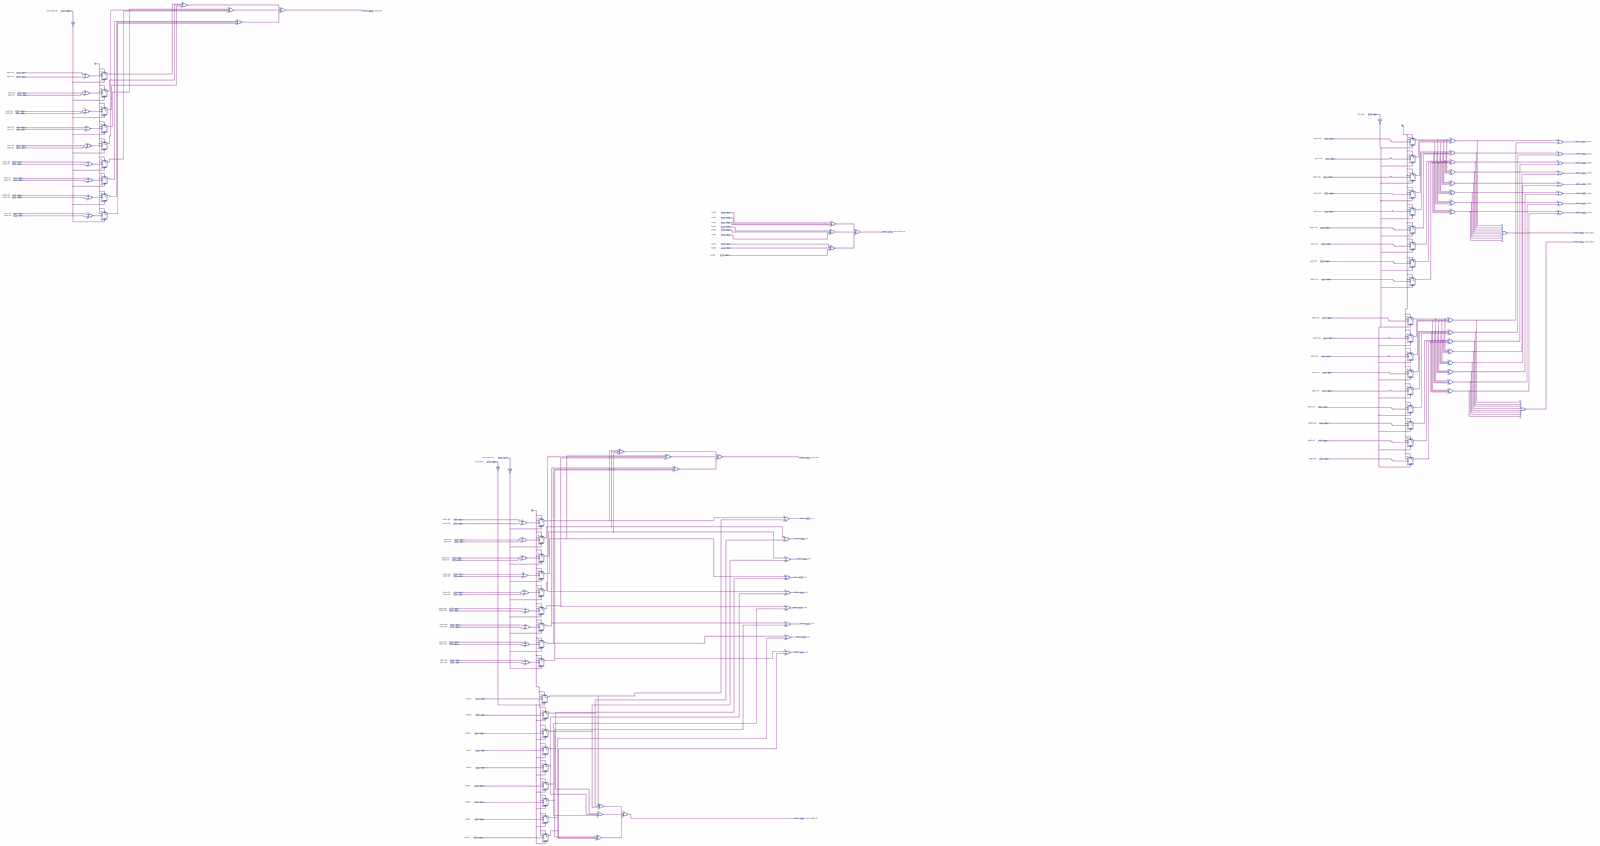
[diagram p0: schematic sheet, whole]
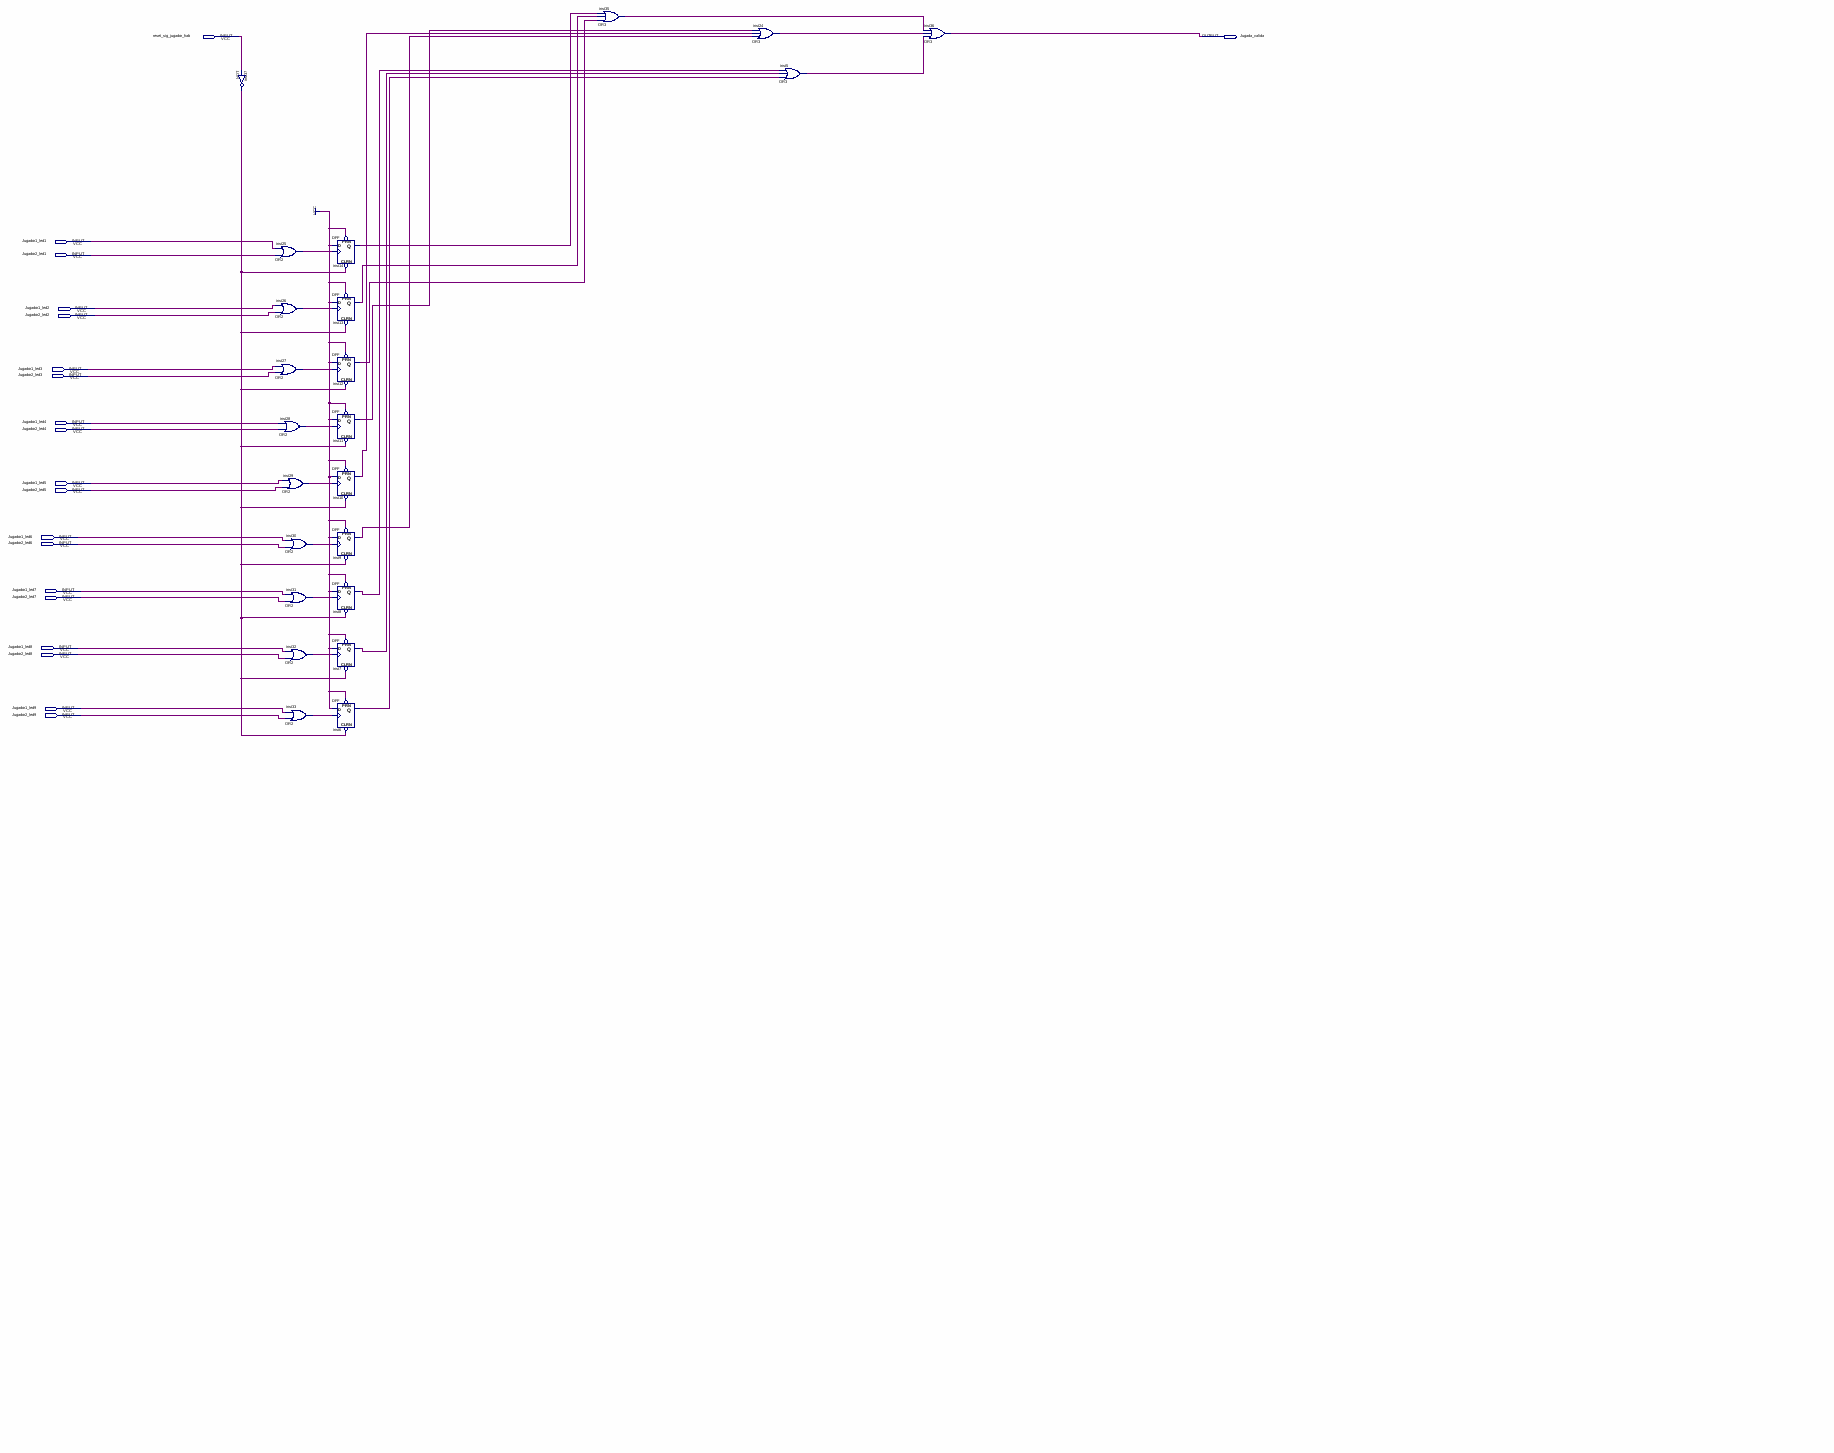
[diagram p1: schematic sheet, upper left part]
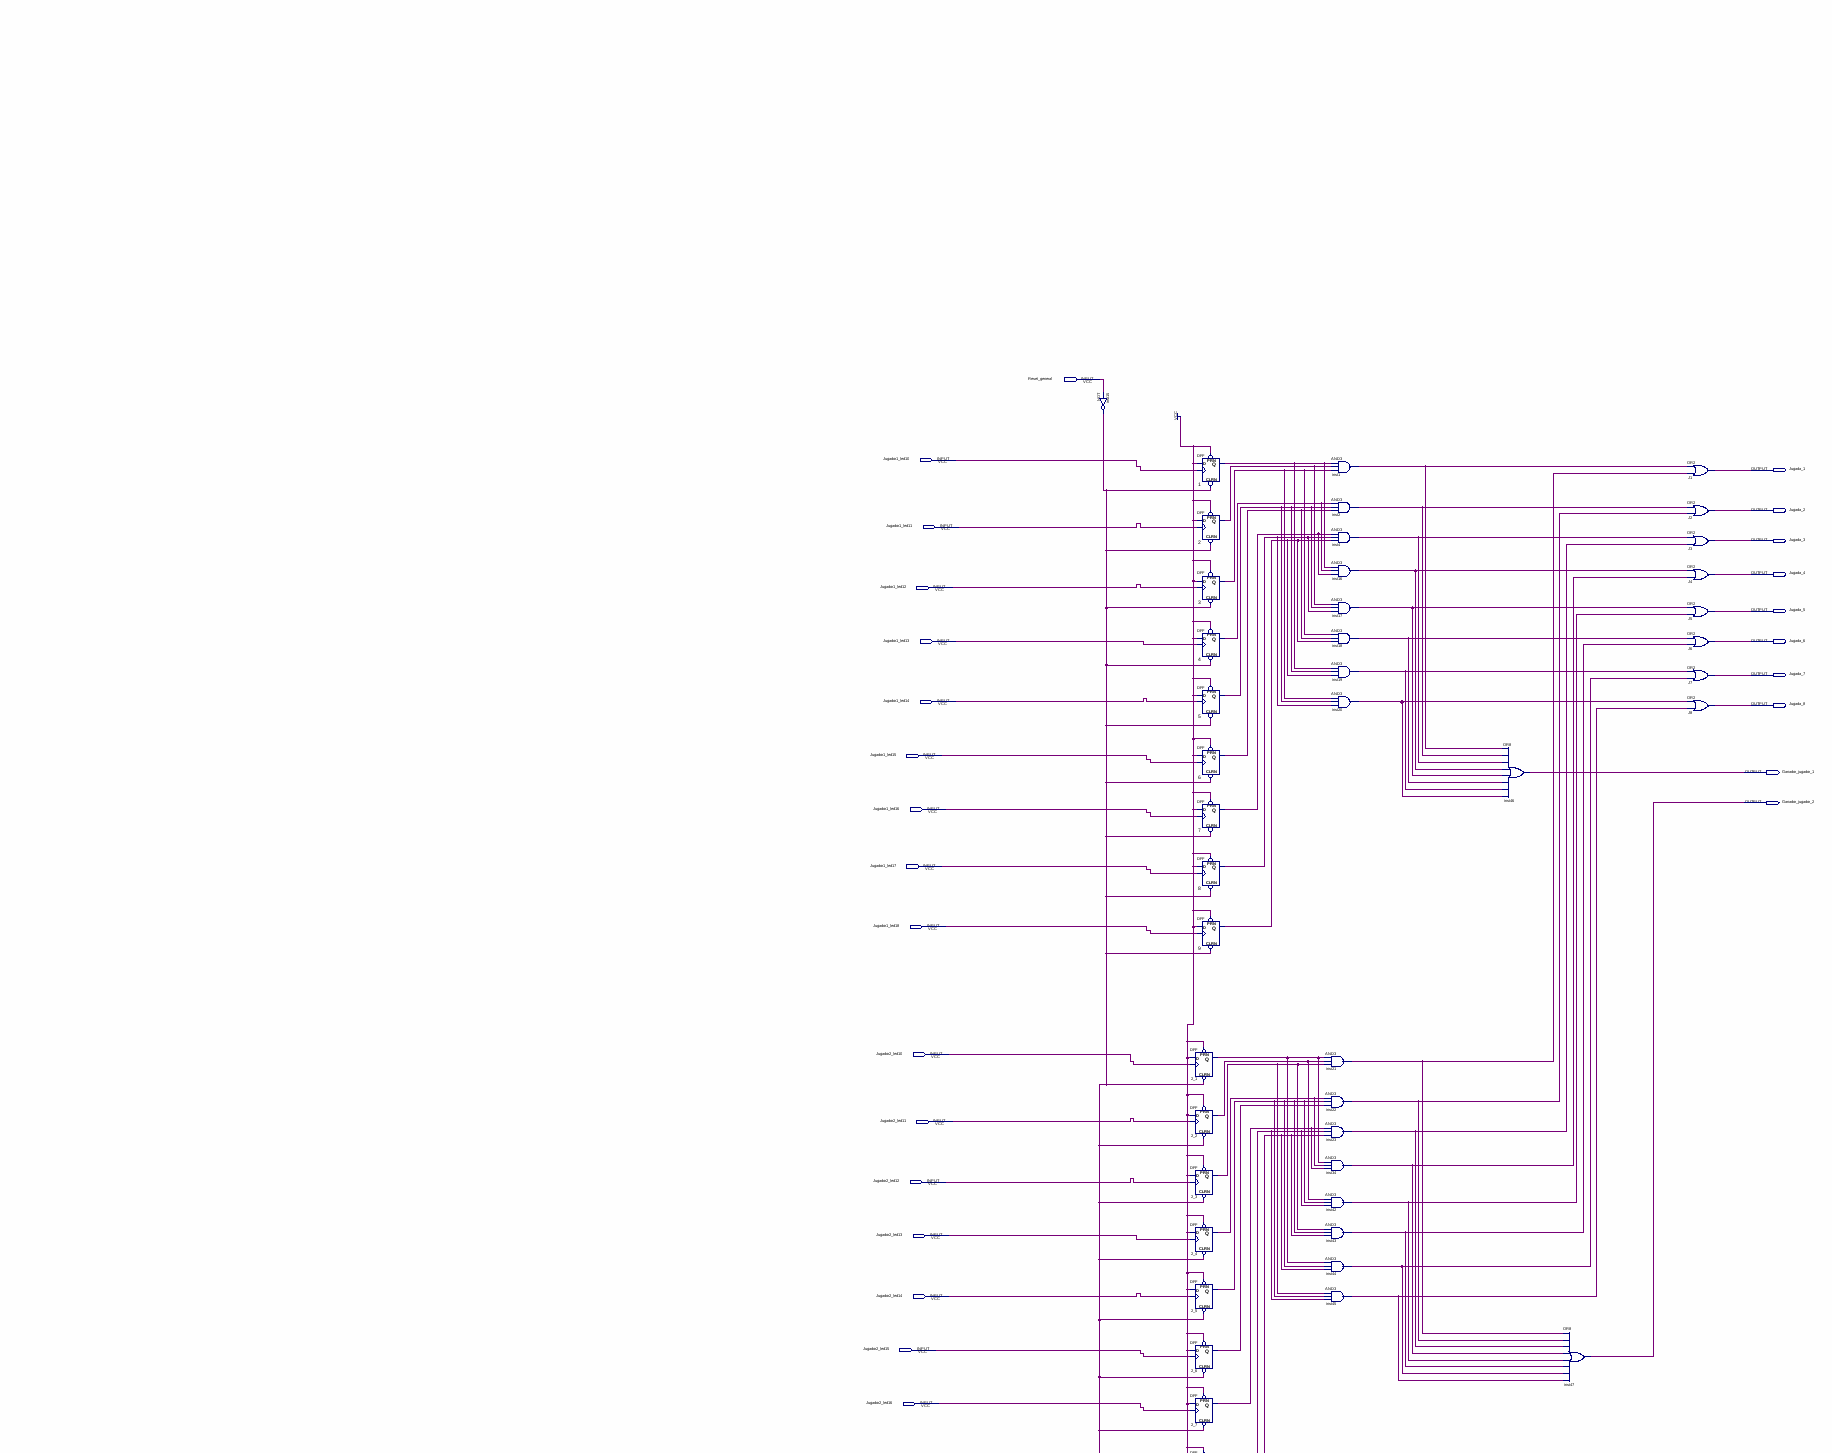
[diagram p2: schematic sheet, upper right part]
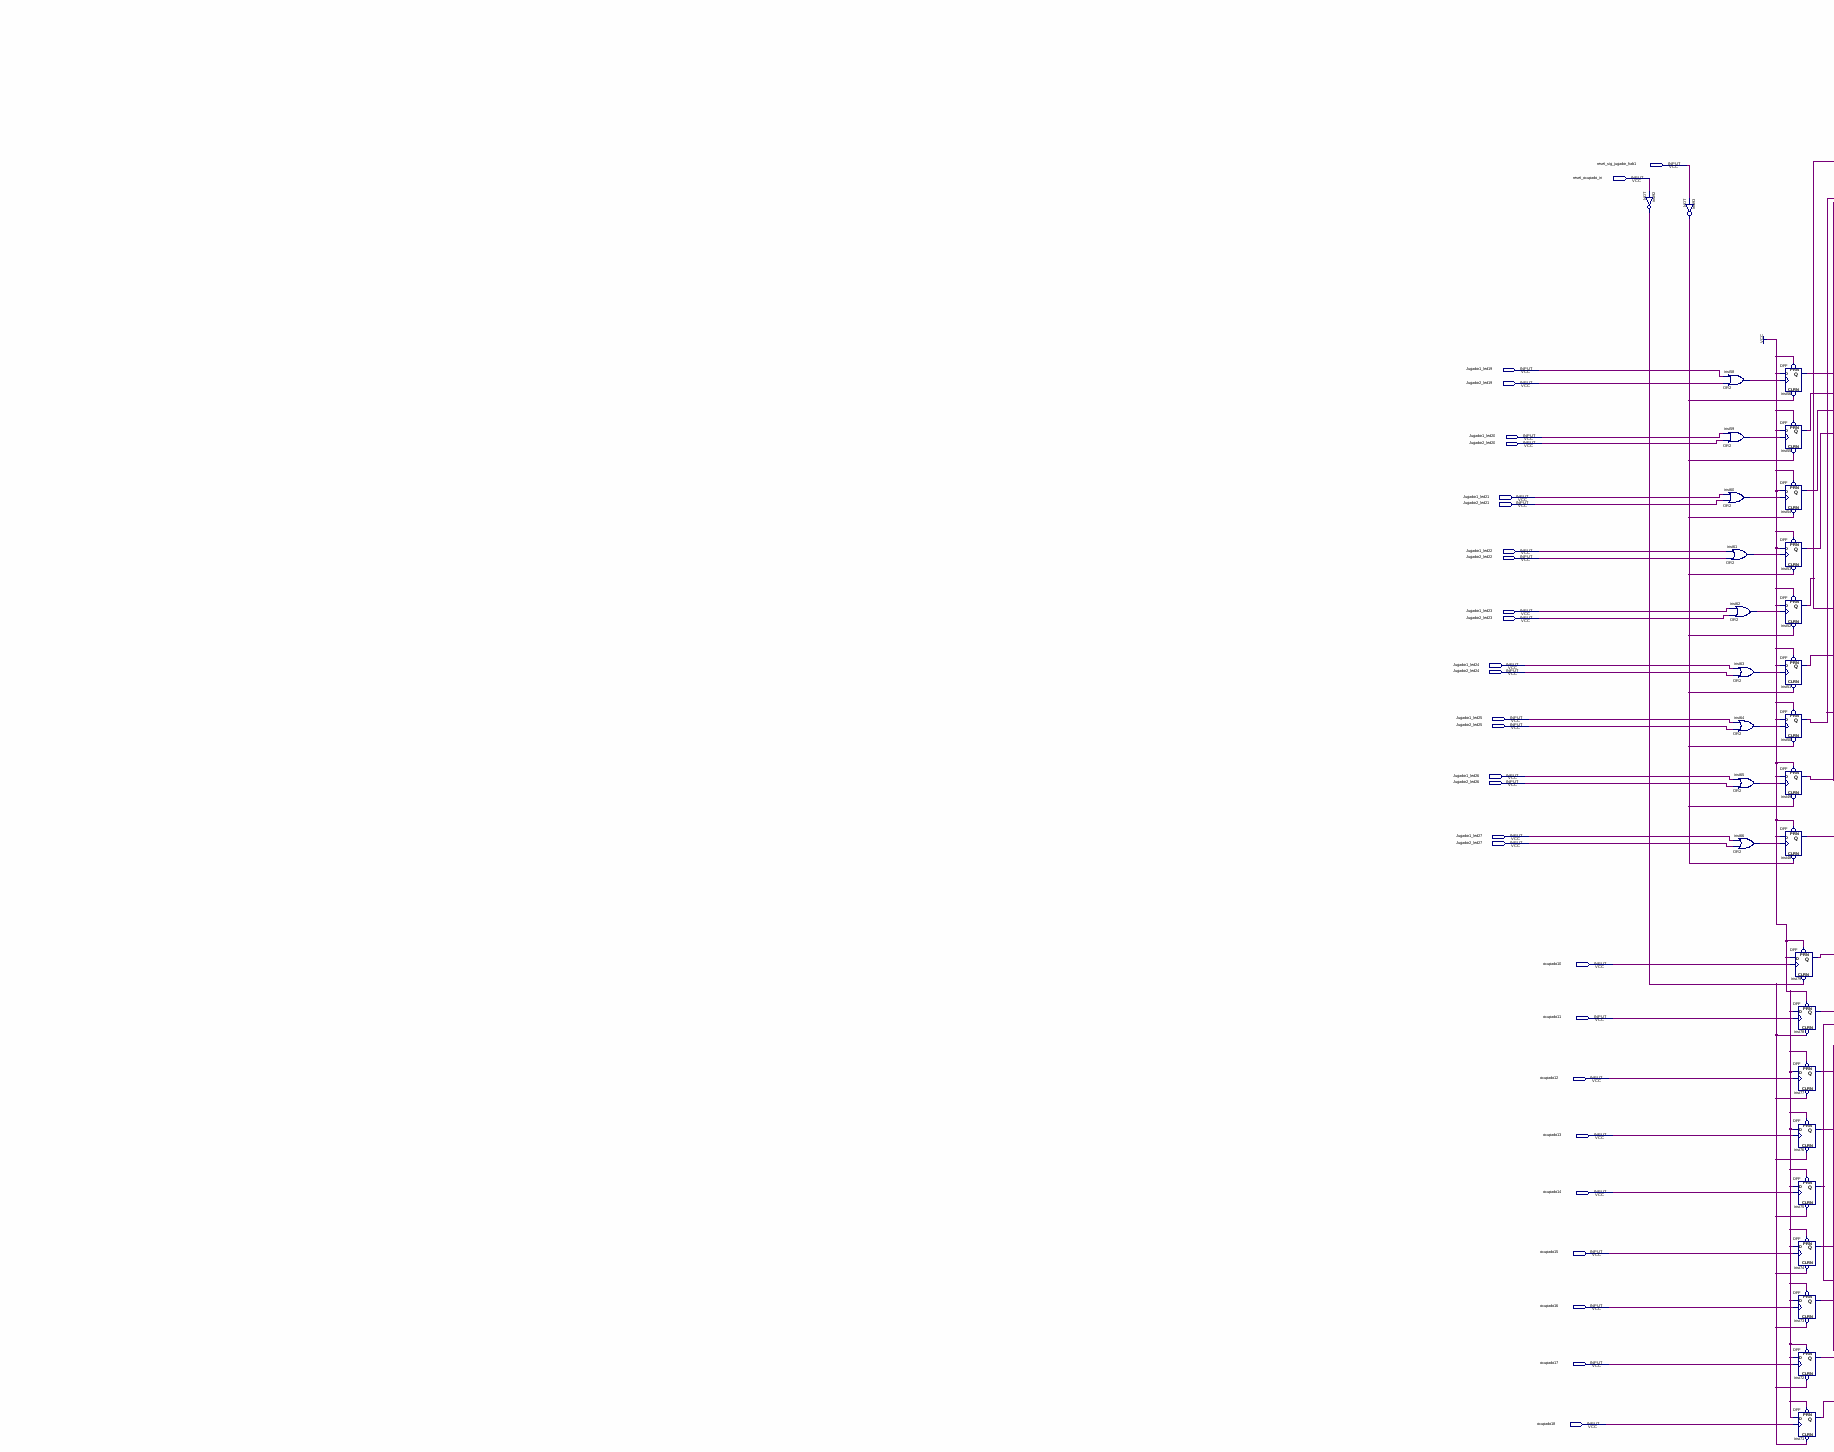
[diagram p3: schematic sheet, lower left part]
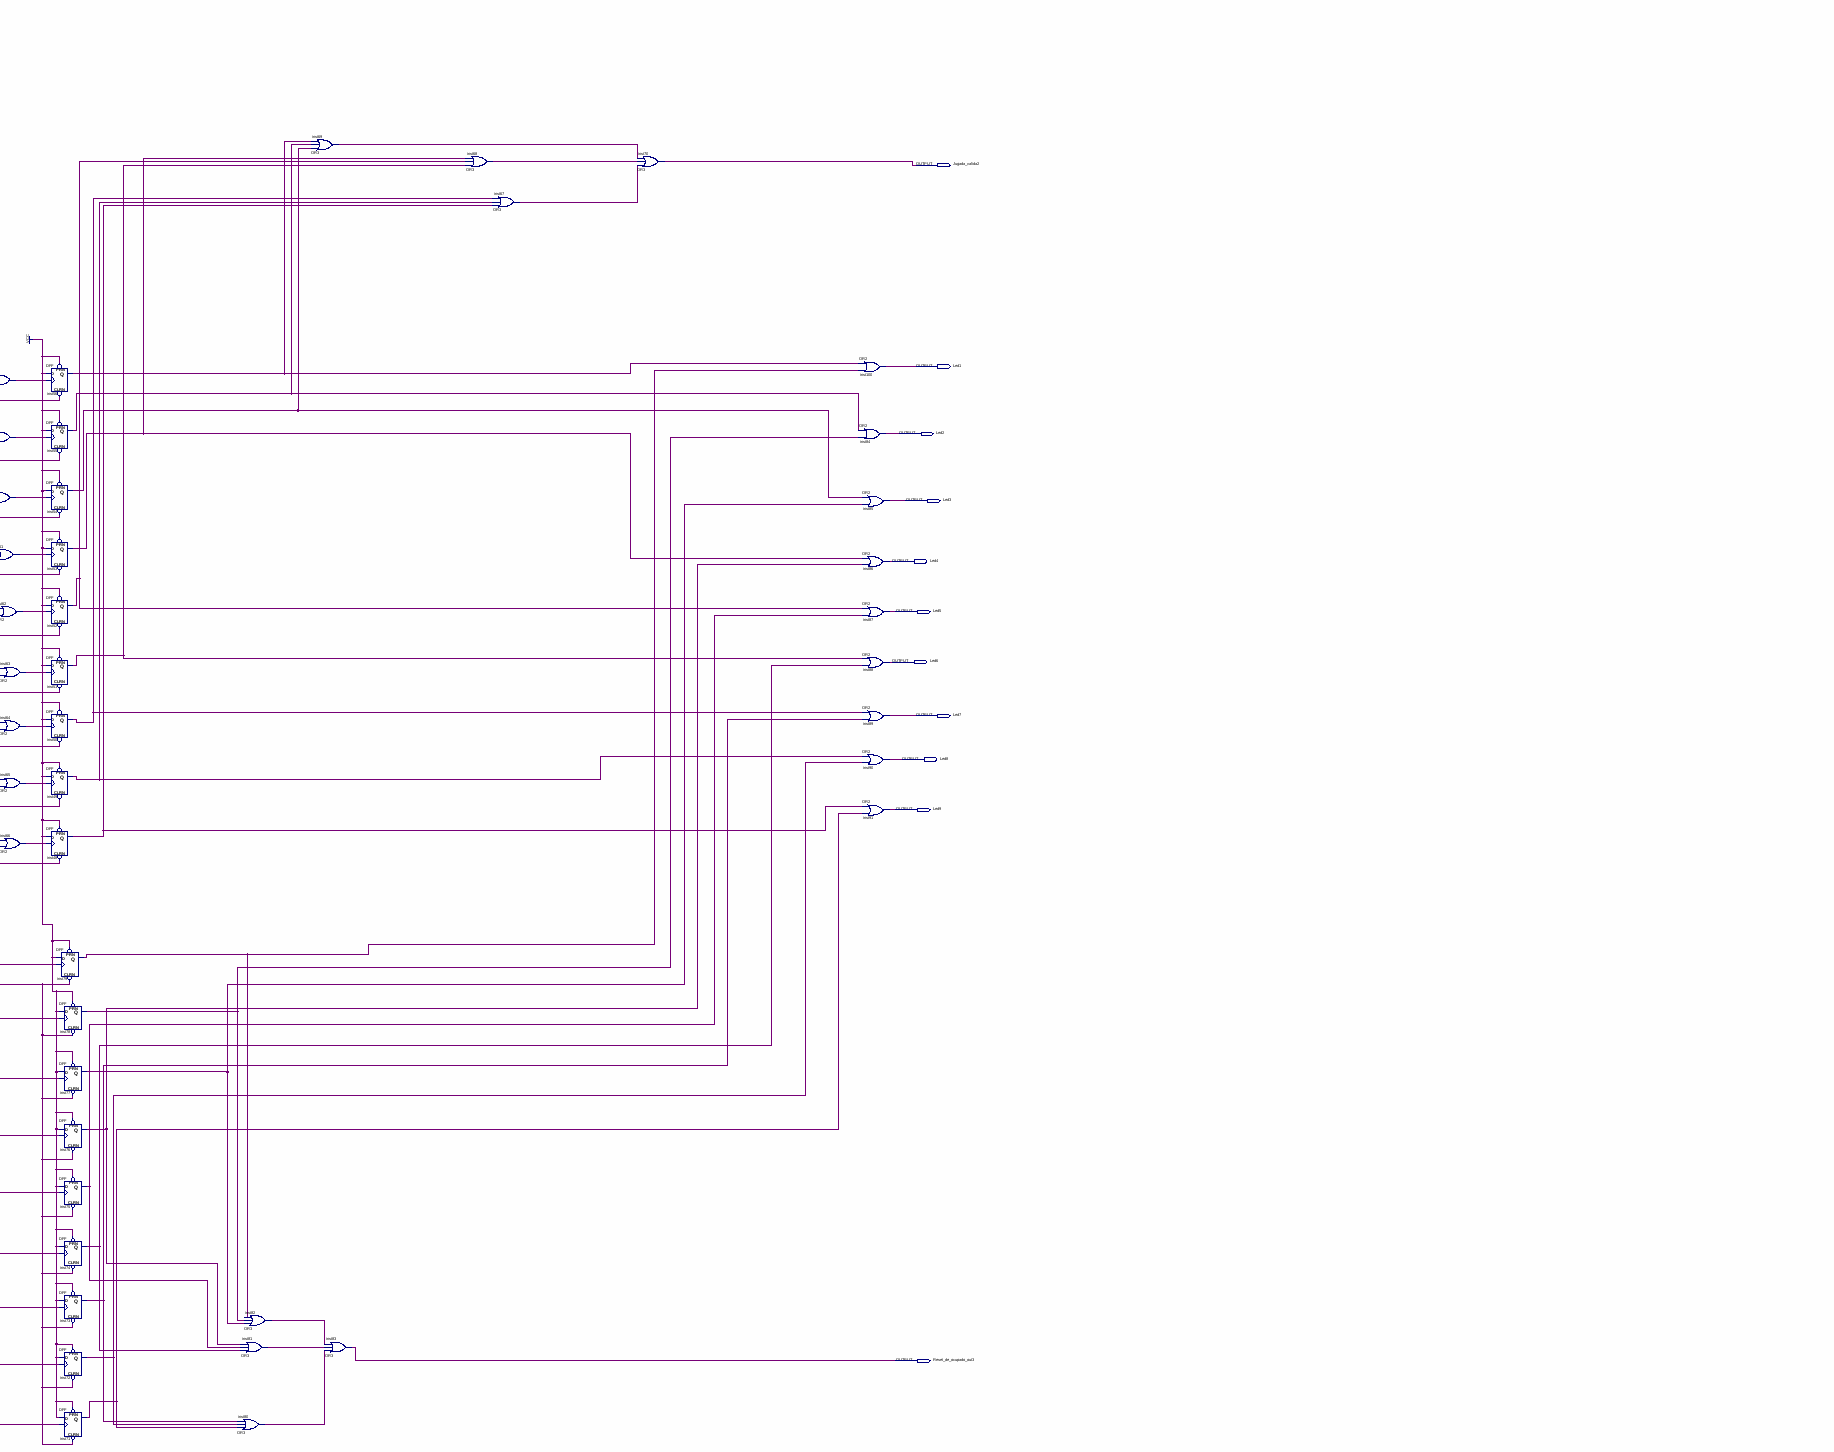
[diagram p4: schematic sheet, lower centre part]
// Quartus schematic bloque_2.bdf as structural Verilog: 118 symbols, 99 pins
module bloque_2 (
  input  reset_sig_jugador_hab,
  input  Jugador1_led1,
  input  Jugador2_led1,
  input  Jugador1_led2,
  input  Jugador2_led2,
  input  Jugador1_led3,
  input  Jugador2_led3,
  input  Reset_general,
  input  Jugador1_led4,
  input  Jugador2_led4,
  input  Jugador1_led10,
  input  Jugador1_led5,
  input  Jugador2_led5,
  input  Jugador1_led11,
  input  Jugador1_led6,
  input  Jugador2_led6,
  input  Jugador1_led12,
  input  Jugador1_led7,
  input  Jugador2_led7,
  input  Jugador1_led13,
  input  Jugador1_led8,
  input  Jugador2_led8,
  input  Jugador1_led14,
  input  ocupado1,
  input  Jugador1_led9,
  input  Jugador2_led9,
  input  ocupado2,
  input  ocupado3,
  input  ocupado4,
  input  Jugador1_led15,
  input  ocupado5,
  input  ocupado6,
  input  ocupado7,
  input  Jugador1_led16,
  input  ocupado8,
  input  ocupado9,
  input  Jugador1_led17,
  input  Jugador1_led18,
  input  Jugador2_led10,
  input  Jugador2_led11,
  input  Jugador2_led12,
  input  Jugador2_led13,
  input  Jugador2_led14,
  input  Jugador2_led15,
  input  Jugador2_led16,
  input  Jugador2_led17,
  input  reset_sig_jugador_hab1,
  input  Jugador2_led18,
  input  reset_ocupado_in,
  input  Jugador1_led19,
  input  Jugador2_led19,
  input  Jugador1_led20,
  input  Jugador2_led20,
  input  Jugador1_led21,
  input  Jugador2_led21,
  input  Jugador1_led22,
  input  Jugador2_led22,
  input  Jugador1_led23,
  input  Jugador2_led23,
  input  Jugador1_led24,
  input  Jugador2_led24,
  input  Jugador1_led25,
  input  Jugador2_led25,
  input  Jugador1_led26,
  input  Jugador2_led26,
  input  Jugador1_led27,
  input  Jugador2_led27,
  input  ocupado10,
  input  ocupado11,
  input  ocupado12,
  input  ocupado13,
  input  ocupado14,
  input  ocupado15,
  input  ocupado16,
  input  ocupado17,
  input  ocupado18,
  output Jugada_valida,
  output Jugada_1,
  output Jugada_2,
  output Jugada_3,
  output Jugada_4,
  output Jugada_5,
  output Jugada_6,
  output Jugada_7,
  output Jugada_8,
  output Reset_de_ocupado_out,
  output Ganador_jugador_1,
  output Ganador_jugador_2,
  output Jugada_valida2,
  output Led1,
  output Led2,
  output Led3,
  output Led4,
  output Led5,
  output Led6,
  output Led7,
  output Led8,
  output Led9,
  output Reset_de_ocupado_out3
);

  wire inst1_out, inst2_out, inst4_out, inst5_out, inst6_q, inst7_q, inst8_q, inst9_q, inst10_q, inst11_q,
       inst12_q, inst13_q, inst14_q, inst15_out, inst16_out, inst17_out, inst18_out, inst19_out, inst20_out,
       inst21_out, inst22_out, inst23_out, inst24_out, inst25_out, inst26_out, inst27_out, inst28_out,
       inst29_out, inst30_out, inst31_out, inst32_out, inst33_out, inst34_out, inst35_out, inst37_out,
       inst38_out, inst39_out, inst40_out, inst42_out, inst43_out, inst44_out, inst45_out, inst48_q,
       inst49_q, inst50_q, inst51_q, inst52_q, inst53_q, inst54_q, inst55_q, inst56_q, inst58_out,
       inst59_out, inst60_out, inst61_out, inst62_out, inst63_out, inst64_out, inst65_out, inst66_out,
       inst67_out, inst68_out, inst69_out, inst71_q, inst72_q, inst73_q, inst74_q, inst75_q, inst76_q,
       inst77_q, inst78_q, inst79_q, inst80_out, inst81_out, inst82_out, inst92_out, inst93_out, n1_q,
       n2_1_q, n2_2_q, n2_3_q, n2_4_q, n2_5_q, n2_6_q, n2_7_q, n2_8_q, n2_9_q, n2_q, n3_q, n4_q, n5_q, n6_q,
       n7_q, n8_q, n9_q;

  not inst37 (inst37_out, reset_sig_jugador_hab);
  or inst25 (inst25_out, Jugador2_led1, Jugador1_led1);
  or inst26 (inst26_out, Jugador2_led2, Jugador1_led2);
  or inst27 (inst27_out, Jugador2_led3, Jugador1_led3);
  or inst28 (inst28_out, Jugador2_led4, Jugador1_led4);
  or inst29 (inst29_out, Jugador2_led5, Jugador1_led5);
  or inst30 (inst30_out, Jugador2_led6, Jugador1_led6);
  or inst31 (inst31_out, Jugador2_led7, Jugador1_led7);
  or inst32 (inst32_out, Jugador2_led8, Jugador1_led8);
  or inst33 (inst33_out, Jugador2_led9, Jugador1_led9);
  DFF inst14 (.CLRN(inst37_out), .CLK(inst25_out), .D(1'b1), .PRN(1'b1), .Q(inst14_q));
  DFF inst13 (.CLRN(inst37_out), .CLK(inst26_out), .D(1'b1), .PRN(1'b1), .Q(inst13_q));
  DFF inst12 (.CLRN(inst37_out), .CLK(inst27_out), .D(1'b1), .PRN(1'b1), .Q(inst12_q));
  DFF inst11 (.CLRN(inst37_out), .CLK(inst28_out), .D(1'b1), .PRN(1'b1), .Q(inst11_q));
  DFF inst10 (.CLRN(inst37_out), .CLK(inst29_out), .D(1'b1), .PRN(1'b1), .Q(inst10_q));
  DFF inst9 (.CLRN(inst37_out), .CLK(inst30_out), .D(1'b1), .PRN(1'b1), .Q(inst9_q));
  DFF inst8 (.CLRN(inst37_out), .CLK(inst31_out), .D(1'b1), .PRN(1'b1), .Q(inst8_q));
  DFF inst7 (.CLRN(inst37_out), .CLK(inst32_out), .D(1'b1), .PRN(1'b1), .Q(inst7_q));
  DFF inst6 (.CLRN(inst37_out), .CLK(inst33_out), .D(1'b1), .PRN(1'b1), .Q(inst6_q));
  or inst35 (inst35_out, inst12_q, inst13_q, inst14_q);
  or inst24 (inst24_out, inst9_q, inst10_q, inst11_q);
  or inst5 (inst5_out, inst6_q, inst7_q, inst8_q);
  or inst36 (Jugada_valida, inst5_out, inst24_out, inst35_out);
  not inst92 (inst92_out, reset_ocupado_in);
  not inst93 (inst93_out, reset_sig_jugador_hab1);
  or inst58 (inst58_out, Jugador2_led19, Jugador1_led19);
  or inst59 (inst59_out, Jugador2_led20, Jugador1_led20);
  or inst60 (inst60_out, Jugador2_led21, Jugador1_led21);
  or inst61 (inst61_out, Jugador2_led22, Jugador1_led22);
  or inst62 (inst62_out, Jugador2_led23, Jugador1_led23);
  or inst63 (inst63_out, Jugador2_led24, Jugador1_led24);
  or inst64 (inst64_out, Jugador2_led25, Jugador1_led25);
  or inst65 (inst65_out, Jugador2_led26, Jugador1_led26);
  or inst66 (inst66_out, Jugador2_led27, Jugador1_led27);
  DFF inst56 (.CLRN(inst93_out), .CLK(inst58_out), .D(1'b1), .PRN(1'b1), .Q(inst56_q));
  DFF inst55 (.CLRN(inst93_out), .CLK(inst59_out), .D(1'b1), .PRN(1'b1), .Q(inst55_q));
  DFF inst54 (.CLRN(inst93_out), .CLK(inst60_out), .D(1'b1), .PRN(1'b1), .Q(inst54_q));
  DFF inst53 (.CLRN(inst93_out), .CLK(inst61_out), .D(1'b1), .PRN(1'b1), .Q(inst53_q));
  DFF inst52 (.CLRN(inst93_out), .CLK(inst62_out), .D(1'b1), .PRN(1'b1), .Q(inst52_q));
  DFF inst51 (.CLRN(inst93_out), .CLK(inst63_out), .D(1'b1), .PRN(1'b1), .Q(inst51_q));
  DFF inst50 (.CLRN(inst93_out), .CLK(inst64_out), .D(1'b1), .PRN(1'b1), .Q(inst50_q));
  DFF inst49 (.CLRN(inst93_out), .CLK(inst65_out), .D(1'b1), .PRN(1'b1), .Q(inst49_q));
  DFF inst48 (.CLRN(inst93_out), .CLK(inst66_out), .D(1'b1), .PRN(1'b1), .Q(inst48_q));
  DFF inst79 (.CLRN(inst92_out), .CLK(ocupado10), .D(1'b1), .PRN(1'b1), .Q(inst79_q));
  DFF inst78 (.CLRN(inst92_out), .CLK(ocupado11), .D(1'b1), .PRN(1'b1), .Q(inst78_q));
  DFF inst77 (.CLRN(inst92_out), .CLK(ocupado12), .D(1'b1), .PRN(1'b1), .Q(inst77_q));
  DFF inst76 (.CLRN(inst92_out), .CLK(ocupado13), .D(1'b1), .PRN(1'b1), .Q(inst76_q));
  DFF inst75 (.CLRN(inst92_out), .CLK(ocupado14), .D(1'b1), .PRN(1'b1), .Q(inst75_q));
  DFF inst74 (.CLRN(inst92_out), .CLK(ocupado15), .D(1'b1), .PRN(1'b1), .Q(inst74_q));
  DFF inst73 (.CLRN(inst92_out), .CLK(ocupado16), .D(1'b1), .PRN(1'b1), .Q(inst73_q));
  DFF inst72 (.CLRN(inst92_out), .CLK(ocupado17), .D(1'b1), .PRN(1'b1), .Q(inst72_q));
  DFF inst71 (.CLRN(inst92_out), .CLK(ocupado18), .D(1'b1), .PRN(1'b1), .Q(inst71_q));
  or inst82 (inst82_out, inst77_q, inst78_q, inst79_q);
  or inst81 (inst81_out, inst74_q, inst75_q, inst76_q);
  or inst80 (inst80_out, inst71_q, inst72_q, inst73_q);
  or inst69 (inst69_out, inst54_q, inst55_q, inst56_q);
  or inst83 (Reset_de_ocupado_out3, inst80_out, inst81_out, inst82_out);
  or inst68 (inst68_out, inst51_q, inst52_q, inst53_q);
  or inst67 (inst67_out, inst48_q, inst49_q, inst50_q);
  or inst70 (Jugada_valida2, inst67_out, inst68_out, inst69_out);
  or inst100 (Led1, inst56_q, inst79_q);
  or inst84 (Led2, inst55_q, inst78_q);
  or inst85 (Led3, inst54_q, inst77_q);
  or inst86 (Led4, inst53_q, inst76_q);
  or inst87 (Led5, inst52_q, inst75_q);
  or inst88 (Led6, inst51_q, inst74_q);
  or inst89 (Led7, inst50_q, inst73_q);
  or inst90 (Led8, inst49_q, inst72_q);
  or inst91 (Led9, inst48_q, inst71_q);
  or inst40 (inst40_out, ocupado3, ocupado2, ocupado1);
  or inst39 (inst39_out, ocupado6, ocupado5, ocupado4);
  or inst38 (inst38_out, ocupado9, ocupado8, ocupado7);
  or inst41 (Reset_de_ocupado_out, inst38_out, inst39_out, inst40_out);
  not inst15 (inst15_out, Reset_general);
  DFF u_1 (.CLRN(inst15_out), .CLK(Jugador1_led10), .D(1'b1), .PRN(1'b1), .Q(n1_q));
  DFF u_2 (.CLRN(inst15_out), .CLK(Jugador1_led11), .D(1'b1), .PRN(1'b1), .Q(n2_q));
  DFF u_3 (.CLRN(inst15_out), .CLK(Jugador1_led12), .D(1'b1), .PRN(1'b1), .Q(n3_q));
  DFF u_4 (.CLRN(inst15_out), .CLK(Jugador1_led13), .D(1'b1), .PRN(1'b1), .Q(n4_q));
  DFF u_5 (.CLRN(inst15_out), .CLK(Jugador1_led14), .D(1'b1), .PRN(1'b1), .Q(n5_q));
  DFF u_6 (.CLRN(inst15_out), .CLK(Jugador1_led15), .D(1'b1), .PRN(1'b1), .Q(n6_q));
  DFF u_7 (.CLRN(inst15_out), .CLK(Jugador1_led16), .D(1'b1), .PRN(1'b1), .Q(n7_q));
  DFF u_8 (.CLRN(inst15_out), .CLK(Jugador1_led17), .D(1'b1), .PRN(1'b1), .Q(n8_q));
  DFF u_9 (.CLRN(inst15_out), .CLK(Jugador1_led18), .D(1'b1), .PRN(1'b1), .Q(n9_q));
  DFF u_2_1 (.CLRN(inst15_out), .CLK(Jugador2_led10), .D(1'b1), .PRN(1'b1), .Q(n2_1_q));
  DFF u_2_2 (.CLRN(inst15_out), .CLK(Jugador2_led11), .D(1'b1), .PRN(1'b1), .Q(n2_2_q));
  DFF u_2_3 (.CLRN(inst15_out), .CLK(Jugador2_led12), .D(1'b1), .PRN(1'b1), .Q(n2_3_q));
  DFF u_2_4 (.CLRN(inst15_out), .CLK(Jugador2_led13), .D(1'b1), .PRN(1'b1), .Q(n2_4_q));
  DFF u_2_5 (.CLRN(inst15_out), .CLK(Jugador2_led14), .D(1'b1), .PRN(1'b1), .Q(n2_5_q));
  DFF u_2_6 (.CLRN(inst15_out), .CLK(Jugador2_led15), .D(1'b1), .PRN(1'b1), .Q(n2_6_q));
  DFF u_2_7 (.CLRN(inst15_out), .CLK(Jugador2_led16), .D(1'b1), .PRN(1'b1), .Q(n2_7_q));
  DFF u_2_8 (.CLRN(inst15_out), .CLK(Jugador2_led17), .D(1'b1), .PRN(1'b1), .Q(n2_8_q));
  DFF u_2_9 (.CLRN(inst15_out), .CLK(Jugador2_led18), .D(1'b1), .PRN(1'b1), .Q(n2_9_q));
  and inst1 (inst1_out, n1_q, n2_q, n3_q);
  and inst2 (inst2_out, n4_q, n5_q, n6_q);
  and inst4 (inst4_out, n7_q, n8_q, n9_q);
  and inst16 (inst16_out, n1_q, n4_q, n7_q);
  and inst17 (inst17_out, n2_q, n5_q, n8_q);
  and inst18 (inst18_out, n3_q, n6_q, n9_q);
  and inst19 (inst19_out, n1_q, n5_q, n9_q);
  and inst20 (inst20_out, n3_q, n5_q, n8_q);
  and inst21 (inst21_out, n2_1_q, n2_2_q, n2_3_q);
  and inst22 (inst22_out, n2_4_q, n2_5_q, n2_6_q);
  and inst23 (inst23_out, n2_7_q, n2_8_q, n2_9_q);
  and inst34 (inst34_out, n2_1_q, n2_4_q, n2_7_q);
  and inst42 (inst42_out, n2_2_q, n2_5_q, n2_8_q);
  and inst43 (inst43_out, n2_3_q, n2_5_q, n2_9_q);
  and inst44 (inst44_out, n2_1_q, n2_5_q, n2_9_q);
  and inst45 (inst45_out, n2_3_q, n2_5_q, n2_8_q);
  or inst46 (Ganador_jugador_1, inst1_out, inst2_out, inst4_out, inst16_out, inst17_out, inst18_out, inst19_out, inst20_out);
  or inst47 (Ganador_jugador_2, inst21_out, inst22_out, inst23_out, inst34_out, inst42_out, inst43_out, inst44_out, inst45_out);
  or J1 (Jugada_1, inst1_out, inst21_out);
  or J2 (Jugada_2, inst2_out, inst22_out);
  or J3 (Jugada_3, inst4_out, inst23_out);
  or J4 (Jugada_4, inst16_out, inst34_out);
  or J5 (Jugada_5, inst17_out, inst42_out);
  or J6 (Jugada_6, inst18_out, inst43_out);
  or J7 (Jugada_7, inst19_out, inst44_out);
  or J8 (Jugada_8, inst20_out, inst45_out);
endmodule
